# Altium project LM2596-12V.PrjPcb
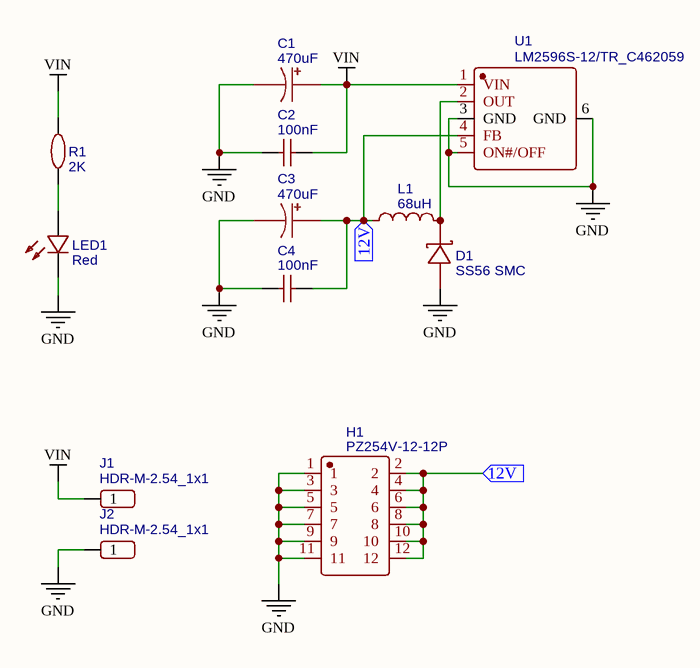
[diagram p0: LM2596-12V.SchDoc]
1 sheet, 12 parts. Net scope: flat (ports and power ports of the same name join across sheets).
Board file: LM2596-12V.PcbDoc

## Sheet LM2596-12V.SchDoc
size A4

### Parts
C1  470uF  [CM G(12.5*13.5)]
C2  100nF  [C 1210_L]
C3  470uF  [CM G(12.5*13.5)]
C4  100nF  [C 1210_L]
D1  SS56 SMC  [SMC]
H1  PZ254V-12-12P  [HDR2X6]
J1  HDR-M-2.54_1x1  [PIN1]
J2  HDR-M-2.54_1x1  [PIN1]
L1  68uH  [CDRH127]
LED1  Red  [LED 0805R]
R1  2K  [R0805]
U1  LM2596S-12/TR_C462059  [TO263-5]

### Ports
12V (in)

### Nets
GND: C1.2 C2.1 C3.2 C4.1 D1.1(A) H1.1 H1.3 H1.5 H1.7 H1.9 H1.11 J2.1 LED1.2(C) U1.3(GND) U1.5(ON#/OFF) U1.6(GND)
VIN: C1.1 C2.2 J1.1 R1.2 U1.1(VIN)
NetC3_1: C3.1 C4.2 H1.2 H1.4 H1.6 H1.8 H1.10 H1.12 L1.1 U1.4(FB) ; port 12V
NetD1_2: D1.2(K) L1.2 U1.2(OUT)
NetLED1_1: LED1.1(A) R1.1

### Library data of the parts
C1 C3 = 470uF: BOM_Manufacturer: LELON; BOM_Manufacturer Part: VEJ471M1HTR-1316; nameAlias: Capacitance; Contributor: LCSC; BOM_Supplier: LCSC; BOM_Supplier Part: C108926; spicePre: C; spiceSymbolName: VEJ471M1HTR-1316
C2 C4 = 100nF: BOM_Manufacturer: HEC; BOM_Manufacturer Part: C1210X104K251T; nameAlias: Capacitance; BOM_Supplier: LCSC; BOM_Supplier Part: C106103; spicePre: C; spiceSymbolName: C1210X104K251T
D1 = SS56 SMC: BOM_Manufacturer: MDD; SMT Type: Extend; BOM_Supplier: LCSC; BOM_Manufacturer Part: SS56 SMC; image: //image.lceda.cn/szlcsc/C24138.jpg; BOM_Supplier Part: C24138; BOM_LCSC Assembly: Yes; spicePre: D; spiceSymbolName: SS56 SMC
H1 = PZ254V-12-12P: BOM_Manufacturer: XFCN; Contributor: LCSC; BOM_Supplier: LCSC; BOM_Supplier Part: C492423; BOM_Manufacturer Part: PZ254V-12-12P; BOM_JLCPCB Part Class: Extended Part; spicePre: H; spiceSymbolName: PZ254V-12-12P
J1 J2 = HDR-M-2.54_1x1: Contributor: LCEDA_Lib; BOM_Supplier Part: C81276; BOM_Supplier: LCSC; spicePre: J; spiceSymbolName: HDR-M-2.54_1x1
L1 = 68uH: BOM_Manufacturer: YJYCOIN; nameAlias: Inductance; Contributor: LCSC; BOM_Supplier: LCSC; BOM_Supplier Part: C497902; spicePre: L; spiceSymbolName: MS1360-680M
LED1 = 17-21SURC/S530-A3/TR8: BOM_Manufacturer: EVERLIGHT; BOM_Supplier: LCSC; BOM_Manufacturer Part: 17-21SURC/S530-A3/TR8; BOM_Supplier Part: C72037; BOM_JLCPCB Part Class: Extended Part; spicePre: L; spiceSymbolName: 17-21SURC/S530-A3/TR8
R1 = 2K: BOM_Manufacturer: UniOhm; BOM_Manufacturer Part: 0805W8J0202T5E; nameAlias: Resistance (Ohms); BOM_Supplier: LCSC; BOM_Supplier Part: C1359; BOM_JLCPCB Part Class: Extended Part; spicePre: R; spiceSymbolName: 0805W8J0202T5E
U1 = LM2596S-12/TR_C462059: BOM_Manufacturer: HGC(Huaguan Semicon); Contributor: LCSC; BOM_Supplier: LCSC; BOM_Supplier Part: C462059; BOM_Manufacturer Part: LM2596S-12/TR; spicePre: U; spiceSymbolName: LM2596S-12/TR_C462059